# Altium schematic sheet LeftPannel.SchDoc
size Letter; SheetNumber: 2; SheetTotal: 4
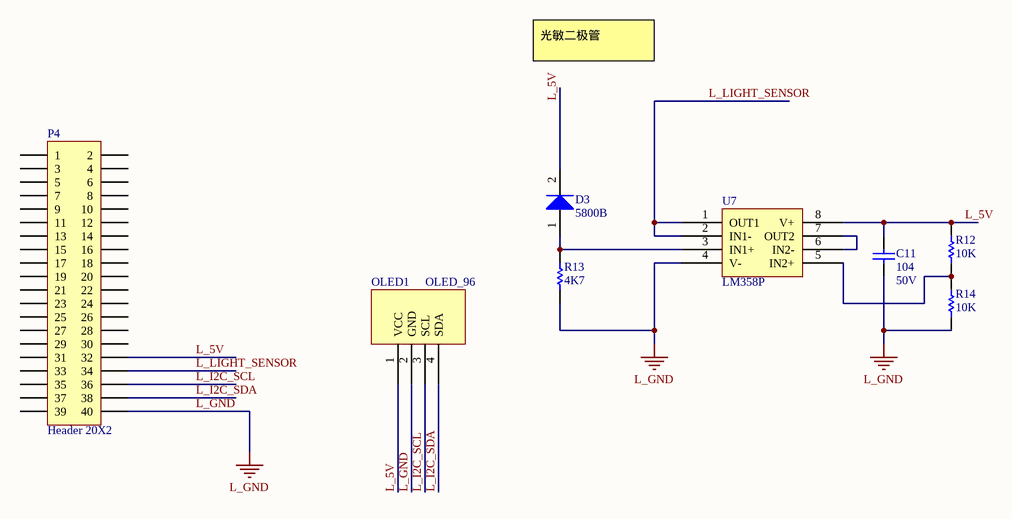
[diagram p0: LeftPannel.SchDoc]

## Parts
C11  50V  value 104  [CAPC1608L]
D3  5800B  [5800B]
OLED1  OLED_96  [OLED_96]
P4  Header 20X2  [HDR2X20]
R12  value 10K  [RESC1608L]  (hidden comment: Res1)
R13  value 4K7  [RESC1608L]  (hidden comment: Res1)
R14  value 10K  [RESC1608L]  (hidden comment: Res1)
U7  LM358P  [DIP-8]

## Nets
L_GND: C11.1 OLED1.2(GND) P4.40 R13.2 R14.2 U7.4(V-)
L_5V: C11.2 D3.2(K) OLED1.1(VCC) P4.32 R12.1 U7.8(V+)
L_I2C_SCL: OLED1.3(SCL) P4.36
L_I2C_SDA: OLED1.4(SDA) P4.38
L_LIGHT_SENSOR: P4.34 U7.1(OUT1) U7.2(IN1-)
NetD3_1: D3.1(A) R13.1 U7.3(IN1+)
NetR12_2: R12.2 R14.1 U7.5(IN2+)
NetU7_6: U7.6(IN2-) U7.7(OUT2)

Not connected (* = marked no-connect by the designer): P4 1 2 3 4 5 6 7 8 9 10 11 12 13 14 15 16 17 18 19 20 21 22 23 24 25 26 27 28 29 30 31 33 35 37 39

## Notes on the sheet
- 光敏二极管

## Library data of the parts
C11 = Cap: Capacitor; Published: 8-Jun-2000; LatestRevisionDate: 17-Jul-2002; LatestRevisionNote: Re-released for DXP Platform.; PackageReference: RAD-0.3; Publisher: Altium Limited; PackageDescription: Radial Cap, Thru-Hole; 2 Leads; 0.3 in Pin Spacing
D3 = Diode: Default Diode; Published: 8-Jun-2000; LatestRevisionDate: 17-Jul-2002; LatestRevisionNote: Re-released for DXP Platform.; PackageVersion: Sep-1996; PackageReference: SMC; Publisher: Altium Limited; PackageDescription: DO-214-AB/SMC; 2 C-Bend Leads; Body 7.9 x 5.9 mm, inc. leads (LxW); Code_JEDEC: DO-214-AB
P4 = Header 20X2: Header, 20-Pin, Dual row; LatestRevisionDate: 17-Jul-2002; LatestRevisionNote: Re-released for DXP Platform.; Publisher: Altium Limited
R12-R14 = Res1: Resistor; Published: 8-Jun-2000; LatestRevisionDate: 17-Jul-2002; LatestRevisionNote: Re-released for DXP Platform.; PackageReference: AXIAL-0.3; Publisher: Altium Limited; PackageDescription: Axial Device, Thru-Hole; 2 Leads; 0.3 in Pin Spacing